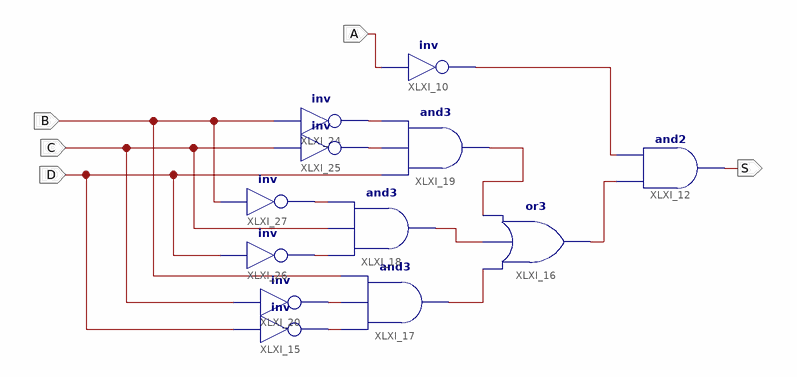
[diagram p0: schematic sheet 1]
// Xilinx ISE schematic ex03.sch (artix7) as structural Verilog: 12 symbols, 5 ports
module ex03 (
  input  A,
  input  B,
  input  C,
  input  D,
  output S
);

  wire XLXN_33, XLXN_44, XLXN_45, XLXN_46, XLXN_53, XLXN_55, XLXN_56, XLXN_57, XLXN_58, XLXN_59, XLXN_60;

  and XLXI_12 (S, XLXN_44, XLXN_33);
  or XLXI_16 (XLXN_44, XLXN_60, XLXN_59, XLXN_58);
  not XLXI_15 (XLXN_45, D);
  not XLXI_20 (XLXN_46, C);
  and XLXI_17 (XLXN_60, XLXN_45, XLXN_46, B);
  and XLXI_18 (XLXN_59, XLXN_53, C, XLXN_57);
  not XLXI_10 (XLXN_33, A);
  not XLXI_26 (XLXN_53, D);
  and XLXI_19 (XLXN_58, D, XLXN_56, XLXN_55);
  not XLXI_24 (XLXN_55, B);
  not XLXI_25 (XLXN_56, C);
  not XLXI_27 (XLXN_57, B);
endmodule
